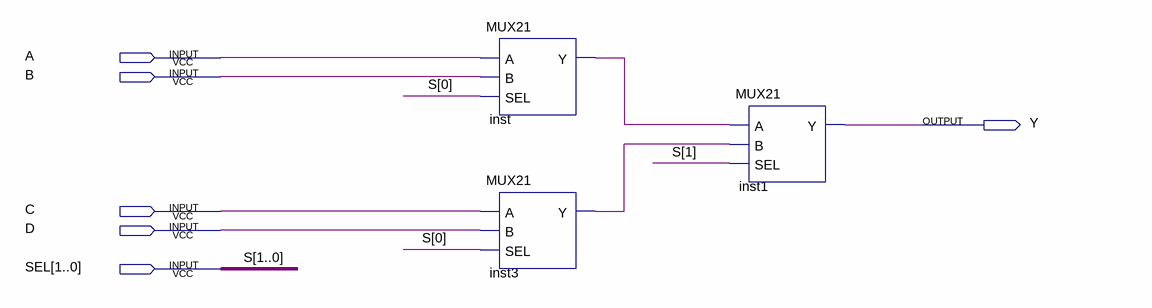
[diagram p0: schematic sheet]
// Quartus schematic MUX41_1BIT.bdf as structural Verilog: 3 symbols, 6 pins
module MUX41_1BIT (
  input  A,
  input  B,
  input  C,
  input  D,
  input  [1:0] SEL,
  output Y
);

  wire inst3_y, inst_y;

  MUX21 inst (.A(A), .B(B), .SEL(SEL[0]), .Y(inst_y));
  MUX21 inst3 (.A(C), .B(D), .SEL(SEL[0]), .Y(inst3_y));
  MUX21 inst1 (.A(inst_y), .B(inst3_y), .SEL(SEL[1]), .Y(Y));

  // Other names for the same wires on the sheet: S[1:0] = SEL
endmodule
